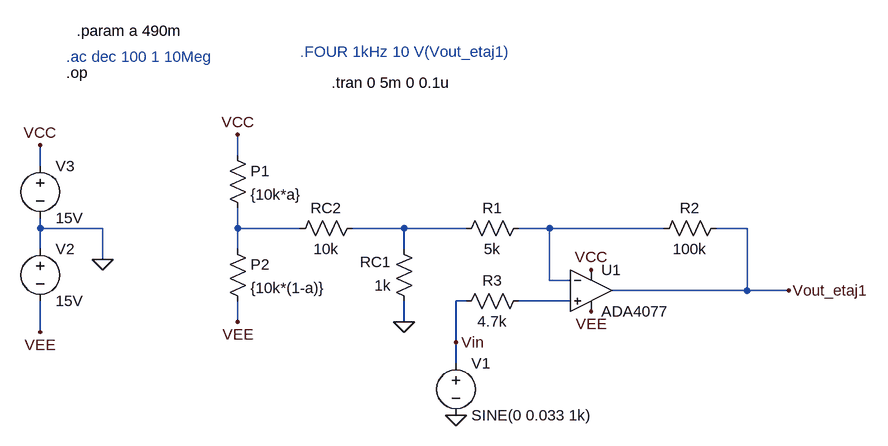
[diagram p0: schematic Amplificator.asc]
Amplificator.asc, the LTspice schematic file:
Version 4
SHEET 1 1112 680
WIRE 128 144 128 112
WIRE -176 160 -176 128
WIRE -176 256 -176 240
WIRE -80 256 -176 256
WIRE 128 256 128 224
WIRE 224 256 128 256
WIRE 384 256 304 256
WIRE 480 256 384 256
WIRE 608 256 560 256
WIRE 784 256 608 256
WIRE 912 256 864 256
WIRE -176 288 -176 256
WIRE 128 288 128 256
WIRE 384 288 384 256
WIRE -80 304 -80 256
WIRE 608 336 608 256
WIRE 640 336 608 336
WIRE 912 352 912 256
WIRE 912 352 704 352
WIRE 976 352 912 352
WIRE 480 368 464 368
WIRE 640 368 560 368
WIRE 128 400 128 368
WIRE 384 400 384 368
WIRE -176 416 -176 368
WIRE 464 432 464 368
WIRE 464 464 464 432
FLAG 464 544 0
FLAG 672 320 VCC
FLAG 672 384 VEE
FLAG 128 112 VCC
FLAG 128 400 VEE
FLAG 384 400 0
FLAG 976 352 Vout_etaj1
FLAG -80 304 0
FLAG -176 128 VCC
FLAG -176 416 VEE
FLAG 464 432 Vin
SYMBOL Opamps/ADA4077 672 288 R0
SYMATTR InstName U1
SYMBOL Res 576 240 R90
WINDOW 0 0 56 VBottom 2
WINDOW 3 32 56 VTop 2
SYMATTR InstName R1
SYMATTR Value 5k
SYMBOL Res 320 240 R90
WINDOW 0 0 56 VBottom 2
WINDOW 3 32 56 VTop 2
SYMATTR InstName RC2
SYMATTR Value 10k
SYMBOL Res 880 240 R90
WINDOW 0 0 56 VBottom 2
WINDOW 3 32 56 VTop 2
SYMATTR InstName R2
SYMATTR Value 100k
SYMBOL Res 400 384 R180
WINDOW 0 36 76 Left 2
WINDOW 3 36 40 Left 2
SYMATTR InstName RC1
SYMATTR Value 1k
SYMBOL Res 464 384 R270
WINDOW 0 32 56 VTop 2
WINDOW 3 0 56 VBottom 2
SYMATTR InstName R3
SYMATTR Value 4.7k
SYMBOL Res 112 128 R0
SYMATTR InstName P1
SYMATTR Value {10k*a}
SYMBOL Res 112 272 R0
SYMATTR InstName P2
SYMATTR Value {10k*(1-a)}
SYMBOL Voltage -176 272 R0
SYMATTR InstName V2
SYMATTR Value 15V
SYMBOL Voltage -176 144 R0
SYMATTR InstName V3
SYMATTR Value 15V
SYMBOL Voltage 464 448 R0
SYMATTR InstName V1
SYMATTR Value SINE(0 0.033 1k)
SYMATTR Value2 AC 1
TEXT -136 16 Left 2 !.op
TEXT -120 -48 Left 2 !.param a 490m
TEXT -136 -8 Left 2 ;.ac dec 100 1 10Meg
TEXT 224 -16 Left 2 ;.FOUR 1kHz 10 V(Vout_etaj1)
TEXT 272 32 Left 2 !.tran 0 5m 0 0.1u

The netlist it stands for:
* Amplificator.asc
XU1 N004 N003 VCC VEE Vout_etaj1 ADA4077  ; pins In+ In- V+ V- OUT
R1 N003 N002 5k
RC2 N002 N001 10k
R2 Vout_etaj1 N003 100k
RC1 0 N002 1k
R3 Vin N004 4.7k
R§P1 VCC N001 {10k*a}
R§P2 N001 VEE {10k*(1-a)}
V2 0 VEE 15V
V3 VCC 0 15V
V1 Vin 0 SINE(0 0.033 1k) AC 1
.op
.param a 490m
* .ac dec 100 1 10Meg
* .FOUR 1kHz 10 V(Vout_etaj1)
.tran 0 5m 0 0.1u
.backanno
.end